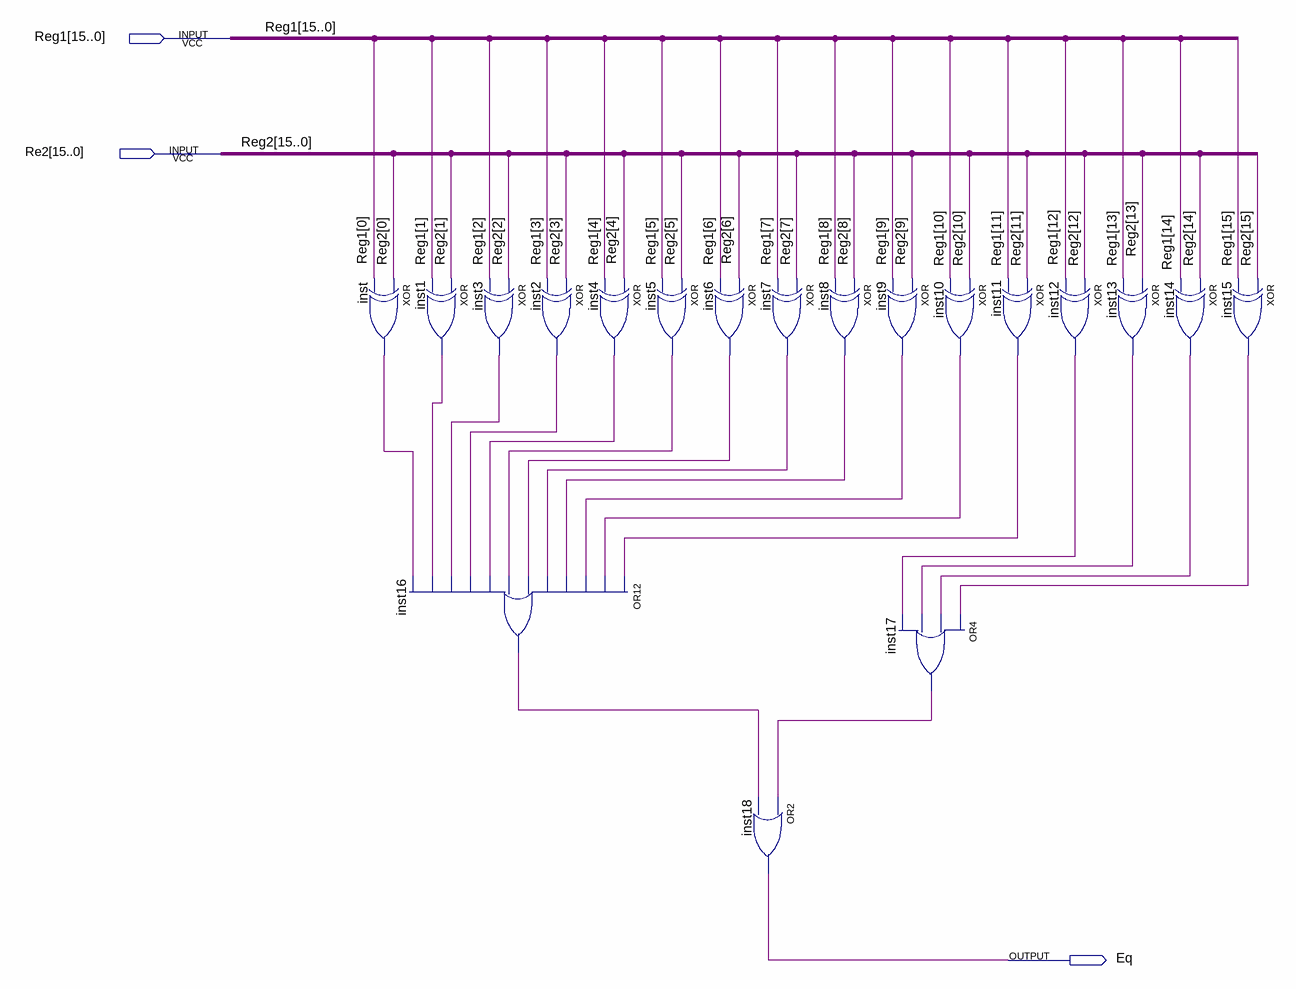
[diagram p0: schematic sheet]
// Quartus schematic Eq.bdf as structural Verilog: 19 symbols, 3 pins
module Eq (
  input  [15:0] Reg1,
  input  [15:0] Re2,
  output Eq
);

  wire inst1_out, inst2_out, inst3_out, inst4_out, inst5_out, inst6_out, inst7_out, inst8_out, inst9_out,
       inst10_out, inst11_out, inst12_out, inst13_out, inst14_out, inst15_out, inst16_out, inst17_out,
       inst_out;

  xor inst (inst_out, Re2[0], Reg1[0]);
  or inst16 (inst16_out, inst11_out, inst10_out, inst9_out, inst8_out, inst7_out, inst6_out, inst5_out, inst4_out, inst2_out, inst3_out, inst1_out, inst_out);
  xor inst1 (inst1_out, Re2[1], Reg1[1]);
  xor inst3 (inst3_out, Re2[2], Reg1[2]);
  xor inst2 (inst2_out, Re2[3], Reg1[3]);
  xor inst4 (inst4_out, Re2[4], Reg1[4]);
  xor inst5 (inst5_out, Re2[5], Reg1[5]);
  xor inst6 (inst6_out, Re2[6], Reg1[6]);
  xor inst7 (inst7_out, Re2[7], Reg1[7]);
  or inst18 (Eq, inst17_out, inst16_out);
  xor inst8 (inst8_out, Re2[8], Reg1[8]);
  xor inst9 (inst9_out, Re2[9], Reg1[9]);
  xor inst10 (inst10_out, Re2[10], Reg1[10]);
  or inst17 (inst17_out, inst15_out, inst14_out, inst13_out, inst12_out);
  xor inst11 (inst11_out, Re2[11], Reg1[11]);
  xor inst12 (inst12_out, Re2[12], Reg1[12]);
  xor inst13 (inst13_out, Re2[13], Reg1[13]);
  xor inst14 (inst14_out, Re2[14], Reg1[14]);
  xor inst15 (inst15_out, Re2[15], Reg1[15]);

  // Other names for the same wires on the sheet: Reg2[15:0] = Re2
endmodule
